# Altium project LimeSDR-X3_1v0.PrjPcb (part 7 of 19)

## Sheet 15_LMS2_RF1_Misc.SchDoc: LMS2 RF1 Misc
size A3; Organization: Lime Microsystems; Address1: Surrey Tech Centre; Address2: Guildford GU2 7YG; Address3: Surrey; Address4: United Kingdom; Revision: v1.0; SheetNumber: 15; SheetTotal: 31
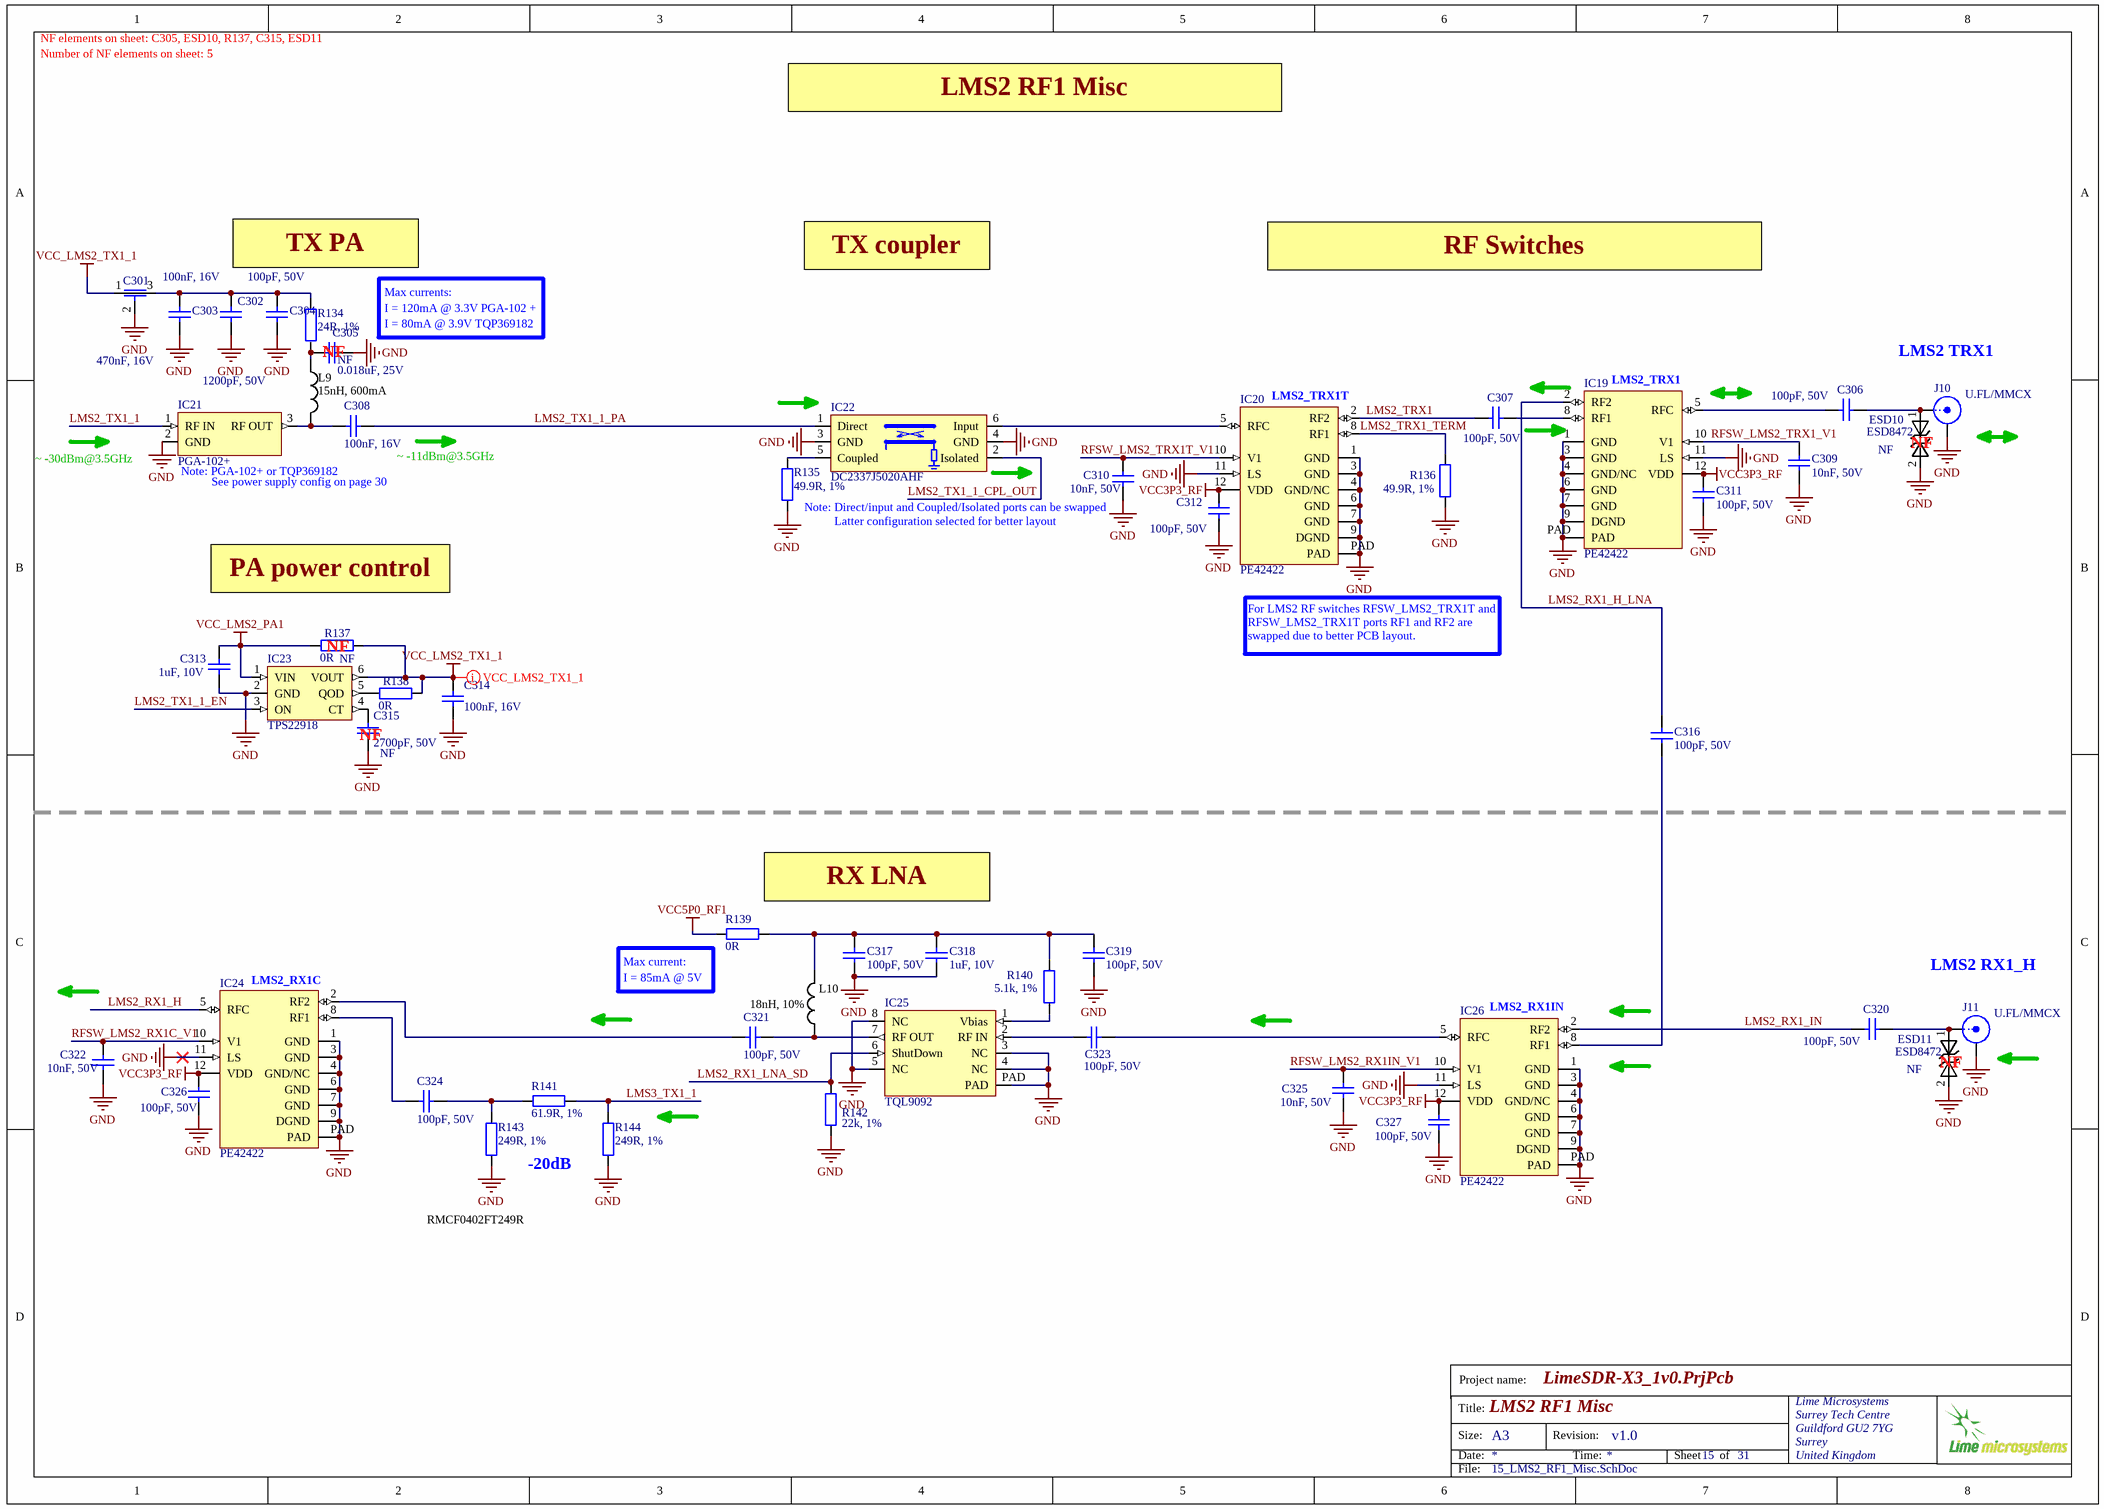
[diagram p14: 15_LMS2_RF1_Misc.SchDoc]

### Parts
C301  470nF, 16V  [CAP0805_FEEDTHROUGH]
C302  1200pF, 50V  [CAP0402]
C303  100nF, 16V  [CAP0402]
C304  100pF, 50V  [CAP0402]
C305  0.018uF, 25V  Assembly Info: NF  [CAP0402]
C306  100pF, 50V  [CAP0402]
C307  100pF, 50V  [CAP0402]
C308  100nF, 16V  [CAP0402]
C309  10nF, 50V  [CAP0402]
C310  10nF, 50V  [CAP0402]
C311  100pF, 50V  [CAP0402]
C312  100pF, 50V  [CAP0402]
C313  1uF, 10V  [CAP0402]
C314  100nF, 16V  [CAP0402]
C315  2700pF, 50V  Assembly Info: NF  [CAP0402]
C316  100pF, 50V  [CAP0402]
C317  100pF, 50V  [CAP0402]
C318  1uF, 10V  [CAP0402]
C319  100pF, 50V  [CAP0402]
C320  100pF, 50V  [CAP0402]
C321  100pF, 50V  [CAP0402]
C322  10nF, 50V  [CAP0402]
C323  100pF, 50V  [CAP0402]
C324  100pF, 50V  [CAP0402]
C325  10nF, 50V  [CAP0402]
C326  100pF, 50V  [CAP0402]
C327  100pF, 50V  [CAP0402]
ESD10  ESD8472  Assembly Info: NF  [ESD8472_X3DFN2]
ESD11  ESD8472  Assembly Info: NF  [ESD8472_X3DFN2]
IC19  PE42422  [PE42422_QFN12]
IC20  PE42422  [PE42422_QFN12]
IC21  PGA-102+  [PGA-102+_SOT89]
IC22  DC2337J5020AHF  [DC2337J5020AHF_ANAREN_COUPLER_0805]
IC23  TPS22918  [SOT23-6]
IC24  PE42422  [PE42422_QFN12]
IC25  TQL9092  [TQL9092]
IC26  PE42422  [PE42422_QFN12]
J10  U.FL/MMCX  [MMCX_UFL_conn_m]
J11  U.FL/MMCX  [MMCX_UFL_conn_m]
L9  15nH, 600mA  [RES0805]
L10  18nH, 10%  [RES0603]
R134  24R, 1%  [RES0402]
R135  49.9R, 1%  [RES0402]
R136  49.9R, 1%  [RES0402]
R137  0R  Assembly Info: NF  [RES0402]
R138  0R  [RES0402]
R139  0R  [RES0402]
R140  5.1k, 1%  [RES0603]
R141  61.9R, 1%  [RES0402]
R142  22k, 1%  [RES0402]
R143  249R, 1%  [RES0402]
R144  249R, 1%  [RES0402]

### Nets
GND: C301.2 C302.2 C303.1 C304.2 C305.2 C309.2 C310.2 C311.1 C312.1 C313.1 C314.1 C315.2 C317.2 C318.1 C319.2 C322.2 C325.2 C326.1 C327.1 ESD10.2 ESD11.2 IC19.1(GND) IC19.3(GND) IC19.4(GND/NC) IC19.6(GND) IC19.7(GND) IC19.9(DGND) IC19.11(LS) IC19.PAD IC20.1(GND) IC20.3(GND) IC20.4(GND/NC) IC20.6(GND) IC20.7(GND) IC20.9(DGND) IC20.11(LS) IC20.PAD IC21.2(GND) IC22.3(GND) IC22.4(GND) IC23.2(GND) IC24.1(GND) IC24.3(GND) IC24.4(GND/NC) IC24.6(GND) IC24.7(GND) IC24.9(DGND) IC24.11(LS) IC24.PAD IC25.3(NC) IC25.4(NC) IC25.5(NC) IC25.8(NC) IC25.PAD IC26.1(GND) IC26.3(GND) IC26.4(GND/NC) IC26.6(GND) IC26.7(GND) IC26.9(DGND) IC26.11(LS) IC26.PAD J10.2(Y) J11.2(Y) R135.2 R136.2 R142.1 R143.1 R144.1
VCC3P3_RF: C311.2 C312.2 C326.2 C327.2 IC19.12(VDD) IC20.12(VDD) IC24.12(VDD) IC26.12(VDD)
VCC5P0_RF1: R139.1
VCC_LMS2_PA1: C313.2 IC23.1(VIN) R137.2
VCC_LMS2_TX1_1: C301.1 C314.2 IC23.6(VOUT) R137.1 R138.1
LMS2_RX1_H: IC24.5(RFC)
LMS2_RX1_H_LNA: C316.2 IC19.2(RF2)
LMS2_RX1_IN: C320.1 IC26.2(RF2)
LMS2_RX1_LNA_SD: IC25.6(ShutDown) R142.2
LMS2_TRX1: C307.1 IC20.2(RF2)
LMS2_TRX1_TERM: IC20.8(RF1) R136.1
LMS2_TX1_1: IC21.1(RF_IN)
LMS2_TX1_1_CPL_OUT: IC22.2(Isolated)
LMS2_TX1_1_EN: IC23.3(ON)
LMS2_TX1_1_PA: C308.1 IC22.1(Direct)
LMS3_TX1_1: R141.2 R144.2
RFSW_LMS2_RX1C_V1: C322.1 IC24.10(V1)
RFSW_LMS2_RX1IN_V1: C325.1 IC26.10(V1)
RFSW_LMS2_TRX1_V1: C309.1 IC19.10(V1)
RFSW_LMS2_TRX1T_V1: C310.1 IC20.10(V1)
NetC301_3: C301.3 C302.1 C303.2 C304.1 R134.1
NetC305_1: C305.1 L9.1 R134.2
NetC306_1: C306.1 IC19.5(RFC)
NetC306_2: C306.2 ESD10.1 J10.1(X)
NetC307_2: C307.2 IC19.8(RF1)
NetC308_2: C308.2 IC21.3(RF_OUT) L9.2
NetC315_1: C315.1 IC23.4(CT)
NetC316_1: C316.1 IC26.8(RF1)
NetC317_1: C317.1 C318.2 C319.1 L10.1 R139.2 R140.2
NetC320_2: C320.2 ESD11.1 J11.1(X)
NetC321_1: C321.1 IC24.2(RF2)
NetC321_2: C321.2 IC25.7(RF_OUT) L10.2
NetC323_1: C323.1 IC25.2(RF_IN)
NetC323_2: C323.2 IC26.5(RFC)
NetC324_1: C324.1 R141.1 R143.2
NetC324_2: C324.2 IC24.8(RF1)
NetIC20_5: IC20.5(RFC) IC22.6(Input)
NetIC22_5: IC22.5(Coupled) R135.1
NetIC23_5: IC23.5(QOD) R138.2
NetIC25_1: IC25.1(Vbias) R140.1

### Layout directives
net class VCC_LMS2_TX1_1: VCC_LMS2_TX1_1

### Notes on the sheet
- NF elements on sheet: C305, ESD10, R137, C315, ESD11
- Number of NF elements on sheet: 5
- LMS2 RF1 Misc
- TX PA
- I = 120mA @ 3.3V PGA-102 +
- Max currents:
- TX coupler
- RF Switches
- (near C301) Ch1
- NF
- I = 80mA @ 3.9V TQP369182
- (near IC19) LMS2_TRX1
- LMS2 TRX1
- (near IC20) LMS2_TRX1T
- (near ESD10) NF
- (near IC21) ~ -30dBm@3.5GHz
- (near IC21) Note: PGA-102+ or TQP369182
- See power supply config on page 30
- (near C308) ~ -11dBm@3.5GHz
- Note: Direct/input and Coupled/Isolated ports can be swapped
- PA power control
- (near C310) Latter configuration selected for better layout
- (near R137) NF
- (near IC20) For LMS2 RF switches RFSW_LMS2_TRX1T and RFSW_LMS2_TRX1T ports RF1 and RF2 are swapped due to better PCB layout.
- (near C315) NF
- RX LNA
- (near IC24) LMS2_RX1C
- I = 85mA @ 5V
- (near R139) Max current:
- LMS2 RX1_H
- (near IC26) LMS2_RX1IN
- (near ESD11) NF
- -20dB
- RMCF0402FT249R
- Project name:
- Title:
- Size:
- Date:
- A3
- Revision:
- Time:
- Sheet
- of
- File:

### Library data of the parts
C301 = Cap_feed_through: as C271 on sheet 14_LMS1_RF_PA; Value: 470nF, 16V; Supplier 1: Digi-Key; Supplier Part Number 1: 490-2537-1-ND; Stock 1: 220606; Pricing 1: 1=0,25000, 10=0,22900, 25=0,21840, 50=0,21160, 100=0,20450, 250=0,19392, 500=0,16218, 1000=0,12586 (USD); Mount: Surface Mount,PCB; Case/Package: 0805; Weight: 0.000194oz; Case Code (Metric): 2012; Case Code (Imperial): 0805; Min Operating Temperature: -55°C; Max Operating Temperature: 125°C; Package Quantity: 1; Capacitance: 470nF; Packaging: Tape and Reel; Max Voltage Rating (DC): 16V; Current Rating: 2A; Voltage Rating: 16V; Voltage Rating (DC): 16V; Voltage: 16V; Current: 2A; Termination: Flat; Length: 2mm; Height: 0.85mm; Width: 1.25mm; Depth: 1.25mm; Radiation Hardening: No; REACH SVHC: No SVHC; Lead Free: Lead Free; RoHS: Yes
C302 = Cap_0402: Manufacturer: Kemet; Manufacturer Part Number 1: C0402C122J5GACTU; Part Description: 1200pF ±5% 50V Ceramic Capacitor C0G, NP0 0402 (1005 Metric); Temperature Coefficient: C0G, NP0; Tolerance: ±5%; Value: 1200pF, 50V; Supplier 1: Digi-Key; Supplier Part Number 1: 399-7334-1-ND; Thickness (Max): 0.022" (0.55mm); Capacitance: 1200pF; Lead Spacing: -; Mounting Type: Surface Mount, MLCC; Package / Case: 0402 (1005 Metric); Category: Capacitors; Size / Dimension: 0.039" L x 0.020" W (1.00mm x 0.50mm); Voltage - Rated: 50V; Lead Style: -; Ratings: -; Features: -; Packaging: Cut Tape (CT); RoHS: RoHS Compliant; Operating Temperature: -55°C ~ 125°C; Applications: General Purpose; Height - Seated (Max): -
C303 C308 C314 = Cap_0402: as C262 on sheet 14_LMS1_RF_PA; Value: 100nF, 16V; Supplier 1: Mouser; Supplier Part Number 1: 81-GRM155R71C104KA88; Case Code - in: 0402; RoHS: RoHS Compliant; Operating Temperature Range: - 55 C to + 125 C; Series: GRM; Termination Style: SMD/SMT; Package / Case: 0402 (1005 metric); Voltage Rating DC: 16 V; Maximum Operating Temperature: + 125 C; Case Code - mm: 1005; Minimum Operating Temperature: - 55 C; Product Category: Low & Medium Capacitance SMD Ceramic Chip Capacitors; Packaging: Reel; Product: General Type MLCCs; Category: Multilayer Ceramic Capacitors MLCC - SMD/SMT; Brand: Murata Electronics; Case Width: 0.5 mm; RoHS - Mouser: Y; Standard Pack Qty: 10000; Minimum Order Quantity: 1; Reeling: True
C304 C306 C307 C311 C312 C316 C317 C319-C321 C323 C324 C326 C327 = Cap_0402: as C264 on sheet 14_LMS1_RF_PA; Value: 100pF, 50V; Capacitance: 100pF; Thickness (Max): 0.022" (0.55mm); Size / Dimension: 0.039" L x 0.020" W (1.00mm x 0.50mm); RoHS: RoHS Compliant; Ratings: -; Package / Case: 0402 (1005 Metric); Mounting Type: Surface Mount, MLCC; Height - Seated (Max): -; Features: -; Lead Spacing: -; Voltage - Rated: 50V; Operating Temperature: -55°C ~ 125°C; Packaging: Cut Tape (CT); Applications: General Purpose; Lead Style: -; Supplier 1: Digi-Key; Category: Capacitors; Supplier Part Number 1: 311-1024-1-ND
C305 = Cap_0402: Part Description: 0.018µF ±10% 25V Ceramic Capacitor X7R 0402 (1005 Metric); Manufacturer: Yageo; Manufacturer Part Number 1: CC0402KRX7R8BB183; Capacitance: 18nF; Tolerance: 10%; Dielectric: X7R; Value: 0.018uF, 25V; ComponentLink1URL: http://www.murata.com/~/media/webrenewal/support/library/catalog/products/capacitor/mlcc/c02e.ashx?la=en-us; ComponentLink1Description: http://www.murata.com/~/media/webrenewal/support/library/catalog/products/capacitor/mlcc/c02e.ashx?la=en-us; Supplier 1: Digi-Key; Supplier Part Number 1: 311-3345-1-ND; Stock 1: 39602; Pricing 1: 1=0,10000, 10=0,05000, 100=0,02210, 500=0,01580, 1000=0,01242, 2500=0,01129, 5000=0,01038 (USD); RoHS: Yes; Mount: Surface Mount; Case/Package: 0402; Min Operating Temperature: -55°C; Max Operating Temperature: 125°C; Packaging: Tape and Reel; Voltage Rating: 25V; Voltage Rating (DC): 25V; Length: 0.039inch; Width: 0.02inch; Thickness: 0.022inch; Lead Free: Lead Free; Halogen Free: Halogen Free; ComponentLink2URL: http://www.yageo.com/documents/recent/UPY-GPHC_X7R_6.3V-to-50V_18.pdf?src-supplier=Digi-Key; ComponentLink2Description: http://www.yageo.com/documents/recent/UPY-GPHC_X7R_6.3V-to-50V_18.pdf?src-supplier=Digi-Key; ComponentLink3URL: http://www.yageo.com/documents/recent/UPY-GPHC_X7R_6.3V-to-50V_16.pdf?src-supplier=Digi-Key; ComponentLink3Description: http://www.yageo.com/documents/recent/UPY-GPHC_X7R_6.3V-to-50V_16.pdf?src-supplier=Digi-Key
C309 C310 C322 C325 = Cap_0402: as C259 on sheet 14_LMS1_RF_PA; Value: 10nF, 50V; Supplier 1: Digi-Key; Supplier Part Number 1: 490-4516-2-ND; RoHS: RoHS Compliant; Category: Capacitors; Stock 1: 10970000; Pricing 1: 10000=0.00185, 20000=0.00176, 30000=0.00167 (USD); Packaging: Tape & Reel (TR); Part Status: Active; Voltage - Rated: 50V; Operating Temperature: -55°C ~ 125°C; Features: -; Ratings: -; Applications: General Purpose; Mounting Type: Surface Mount, MLCC; Package / Case: 0402 (1005 Metric); Size / Dimension: 0.039" L x 0.020" W (1.00mm x 0.50mm); Height - Seated (Max): -; Thickness (Max): 0.022" (0.55mm); Lead Spacing: -; Lead Style: -; ComponentLink1URL: http://www.murata.com/~/media/webrenewal/support/library/catalog/products/capacitor/mlcc/c02e.ashx?la=en-us; ComponentLink1Description: http://www.murata.com/~/media/webrenewal/support/library/catalog/products/capacitor/mlcc/c02e.ashx?la=en-us
C313 C318 = Cap_0402: as C261 on sheet 14_LMS1_RF_PA; Value: 1uF, 10V; Supplier 1: Digi-Key; Supplier Part Number 1: 445-9066-1-ND; MSL: -; RoHS: YES
C315 = Cap_0402: as C265 on sheet 14_LMS1_RF_PA; Value: 2700pF, 50V; Size / Dimension: 0.039" L x 0.020" W (1.00mm x 0.50mm); Supplier 1: Digi-Key; Height - Seated (Max): -; Package / Case: 0402 (1005 Metric); Supplier Part Number 1: 490-6361-1-ND; Part Status: Active; RoHS: RoHS Compliant; Operating Temperature: -55°C ~ 125°C; Category: Capacitors; Ratings: -; Features: -; Packaging: Cut Tape (CT); Mounting Type: Surface Mount, MLCC; Voltage - Rated: 50V; Lead Spacing: -; Thickness (Max): 0.022" (0.55mm); Applications: General Purpose
ESD10 ESD11 = ESD8472: as ESD8 on sheet 14_LMS1_RF_PA; Supplier 1: Digi-Key; RoHS: RoHS Compliant; Category: Circuit Protection; Stock 1: 2295; Pricing 1: 1=0.39, 10=0.315, 100=0.2142, 500=0.16068, 1000=0.12051 (USD); Packaging: Cut Tape (CT); Part Status: Active; Type: Zener; Power - Peak Pulse: -; Applications: Automotive, RF Antenna; Operating Temperature: -55°C ~ 150°C (TJ); Mounting Type: Surface Mount; Package / Case: 2-XFDFN; Supplier Device Package: 2-X3DFN (0.62x0.32); ComponentLink1URL: http://www.onsemi.com/pub/Collateral/ESD8472-D.PDF; ComponentLink1Description: http://www.onsemi.com/pub/Collateral/ESD8472-D.PDF; Supplier Part Number 1: ESD8472MUT5GOSCT-ND
IC19 IC20 IC24 IC26 = PE42422: Manufacturer: Peregrine Semiconductor; Manufacturer Part Number 1: PE42422MLAA-Z; Part Description: IC RF SWITCH SPDT 50 OHM 12QFN; Frequency - Lower: 100MHz; Isolation @ Frequency: 17dB @ 6GHz (typ); Insertion Loss @ Frequency: 0.9dB @ 6GHz; IIP3: 70dBm (typ); Topology: Reflective; Circuit: SPDT; Impedance: 50 Ohm; Voltage - Supply: 2.3 V ~ 5.5 V; RF Type: General Purpose; Supplier 1: Digi-Key; RoHS: RoHS Compliant; Category: RF/IF and RFID; Stock 1: 21993; Pricing 1: 1=1.32, 101=0.92 (USD); Packaging: Cut Tape (CT); Part Status: Active; P1dB: -; Features: -; Operating Temperature: -40°C ~ 85°C; Package / Case: 12-UFQFN Exposed Pad; Supplier Device Package: 12-QFN (2x2); ComponentLink1URL: http://www.psemi.com/pdf/datasheets/pe42422ds.pdf; ComponentLink1Description: http://www.psemi.com/pdf/datasheets/pe42422ds.pdf; Supplier Part Number 1: 1046-1062-1-ND
IC21 = PGA-102+_PA: Part Description: RF Amplifier DC-6GHz NF 3.9dB Gain 21.3dB 50 Ohm; Manufacturer: Qorvo; Manufacturer Part Number 1: TQP369182; Supplier Part Number 1: 772-TQP369182; Supplier 1: Mouser
IC22 = DC2337J5020AHF_coupler: Part Description: RF Directional Coupler General Purpose 2.3GHz ~ 3.7GHz 21.3dB 2W 0805 (2012 Metric); Manufacturer: Anaren; Supplier Part Number 1: 1173-1090-2-ND; Manufacturer Part Number 1: DC2337J5020AHF; Supplier 1: Digi-Key
IC23 = TPS22918: as IC13 on sheet 14_LMS1_RF_PA; Supplier 1: Digi-Key; RoHS: RoHS Compliant; Category: Integrated Circuits (ICs); Stock 1: 16592; Pricing 1: 1=0.63, 10=0.551, 100=0.4222 (USD); Packaging: Digi-Reel®; Part Status: Active; Features: Load Discharge, Slew Rate Controlled; Fault Protection: -; Operating Temperature: -40°C ~ 105°C (TA); Package / Case: SOT-23-6; Supplier Device Package: SOT-23-6; ComponentLink1URL: http://www.ti.com/lit/ds/symlink/tps22918.pdf; ComponentLink1Description: http://www.ti.com/lit/ds/symlink/tps22918.pdf; Supplier Part Number 1: 296-44073-6-ND
IC25 = TQL9092: Part Description: RF Amplifier .6-4.2GHz NF .6dB Flat Gain 2dB; Manufacturer: Qorvo; Manufacturer Part Number 1: TQL9092; Supplier 1: Mouser; Supplier Part Number 1: 772-TQL9092
J10 J11 = RF_IF_connector: as J8 on sheet 14_LMS1_RF_PA; Fastening Type: SNAP-ON; Housing Color: Black; Packaging: Tape and Reel; RoHS: Yes; Supplier 1: Digi-Key; Supplier Part Number 1: ARF1725CT-ND; Body Plating: Gold; Case/Package: 908; ComponentLink1Description: https://datasheet.ciiva.com/5177/c908-22101t-37976-5177328.pdf?src-supplier=Mouser; ComponentLink1URL: https://datasheet.ciiva.com/5177/c908-22101t-37976-5177328.pdf?src-supplier=Mouser; ComponentLink2Description: https://datasheet.ciiva.com/643/c908-22101t-643558.pdf?src-supplier=Digi-Key; ComponentLink2URL: https://datasheet.ciiva.com/643/c908-22101t-643558.pdf?src-supplier=Digi-Key; ComponentLink3Description: https://datasheet.ciiva.com/7662/1636995-7662651.pdf?src-supplier=Element14; ComponentLink3URL: https://datasheet.ciiva.com/7662/1636995-7662651.pdf?src-supplier=Element14; ComponentLink4Description: https://datasheet.ciiva.com/5689/c908-22101t-5689787.pdf?src-supplier=Farnell; ComponentLink4URL: https://datasheet.ciiva.com/5689/c908-22101t-5689787.pdf?src-supplier=Farnell; ComponentLink5Description: https://datasheet.ciiva.com/7996/691284-7996807.pdf?src-supplier=Element14; ComponentLink5URL: https://datasheet.ciiva.com/7996/691284-7996807.pdf?src-supplier=Element14; ComponentLink6Description: https://datasheet.ciiva.com/643/c908-22101t-643559.pdf?src-supplier=Digi-Key; ComponentLink6URL: https://datasheet.ciiva.com/643/c908-22101t-643559.pdf?src-supplier=Digi-Key; ComponentLink7Description: https://datasheet.ciiva.com/643/c908-22101t-643560.pdf?src-supplier=Digi-Key; ComponentLink7URL: https://datasheet.ciiva.com/643/c908-22101t-643560.pdf?src-supplier=Digi-Key; Contact Material: Copper; Contact Plating: Gold; Depth: 4.32mm; Insulation Material: Polymer; Length: 4.32mm; Max Frequency: 6GHz; Max Operating Temperature: 155°C; Min Operating Temperature: -40°C; Mount: Surface Mount,PCB; Orientation: Straight; Package Quantity: 1; Plating: Gold; Pricing 1: 1=6,18000, 10=5,60700, 25=5,31040, 50=5,18700, 100=4,94000, 250=4,32248, 500=4,19900 (USD); Radiation Hardening: No; REACH SVHC: Unknown; Series: MicroMate™; Stock 1: 6928; Termination: Solder
L9 = Inductor_0603: Manufacturer: Bourns; Manufacturer Part Number 1: CW201212-15NJ; Part Description: 15nH Unshielded Wirewound Inductor 600mA 80mOhm 0805 (2012 Metric); Core Material: Ceramic; Tolerance: 5%; Self Resonant Frequency: 3.6GHz; Shielding: Unshielded; Q Factor: 60; DC Resistance (DCR): 80mR; Test Frequency: 250MHz; Value: 15nH, 600mA; Supplier 1: Digi-Key; Supplier Part Number 1: CW201212-15NJDKR-ND; Stock 1: 2733; Pricing 1: 1=0.37, 10=0.327, 100=0.2245, 500=0.19188, 1000=0.14697 (USD); Mount: Surface Mount; Case/Package: 0805; Weight: 0.000194oz; Case Code (Metric): 2012; Case Code (Imperial): 0805; Min Operating Temperature: -40°C; Max Operating Temperature: 125°C; Package Quantity: 2000; Packaging: Tape and Reel; Current Rating: 600mA; Inductance: 15nH; Max DC Current: 600mA; Termination: SMD/SMT; Composition: Wirewound,Ceramic; DC Current: 600mA; Military Standard: Not; Length: 0.083inch; Height: 0.051inch; Width: 1.5mm; Height - Seated (Max): 0.059inch; Depth: 1.7mm; Radiation Hardening: No; ComponentLink1URL: http://www.bourns.com/data/global/PDFs/CW201212.pdf?src-supplier=Avnet+Europe; ComponentLink1Description: http://www.bourns.com/data/global/PDFs/CW201212.pdf?src-supplier=Avnet+Europe; ComponentLink2URL: http://www.bourns.com/data/global/pdfs/CW201212.pdf?src-supplier=Digi-Key; ComponentLink2Description: http://www.bourns.com/data/global/pdfs/CW201212.pdf?src-supplier=Digi-Key; ComponentLink3URL: http://www.bourns.com/data/global/PDFs/CW201212.pdf?src-supplier=Avnet; ComponentLink3Description: http://www.bourns.com/data/global/PDFs/CW201212.pdf?src-supplier=Avnet; ComponentLink4URL: http://www.onlinecomponents.com/productFiles/mf-BO/cw201212.pdf?src-supplier=Onlinecomponents.com; ComponentLink4Description: http://www.onlinecomponents.com/productFiles/mf-BO/cw201212.pdf?src-supplier=Onlinecomponents.com
L10 = Inductor: as L1 on sheet 14_LMS1_RF_PA; Value: 18nH, 10%; Supplier 1: Digi-Key; Supplier Part Number 1: 1840-1105-1-ND; RoHS: RoHS Compliant; Category: Inductors, Coils, Chokes; Stock 1: 14000; Pricing 1: 1=0.41, 10=0.368, 100=0.253, 500=0.2162, 1000=0.1656 (USD); Packaging: Cut Tape (CT); Part Status: Active; Tolerance: ±10%; Ratings: -; Operating Temperature: -40°C ~ 125°C; Mounting Type: Surface Mount; Package / Case: 0603 (1608 Metric); Supplier Device Package: 0603 (1608 Metric); Size / Dimension: 0.071" L x 0.049" W (1.80mm x 1.24mm); Height - Seated (Max): 0.040" (1.02mm); ComponentLink1URL: http://productfinder.pulseeng.com/products/datasheets/WC701.pdf; ComponentLink1Description: http://productfinder.pulseeng.com/products/datasheets/WC701.pdf
R134 = Res_0402: as R111 on sheet 14_LMS1_RF_PA; Value: 24R, 1%; Supplier 1: Digi-Key; Supplier Part Number 1: 13-AC0402FR-0724RLCT-ND; Stock 1: 14420; Pricing 1: 1=0.1, 10=0.022, 100=0.009, 1000=0.00402, 2500=0.00349, 5000=0.00288 (USD); Case/Package: 0402; Min Operating Temperature: -55°C; Max Operating Temperature: 155°C; Packaging: Tape and Reel; Resistance: 24R; Resistor Type: Thick Film; Number of Terminations: 2; Tolerance: 1%; Features: Moisture Resistant,Automotive AEC-Q200; Length: 0.039inch; Width: 0.02inch; Height: 0.015inch; RoHS Compliant: Yes; ComponentLink1URL: http://www.yageo.com/NewPortal/yageodocoutput?fileName=/pdf/R-Chip/PYu-AC_51_RoHS_L_6.pdf&src-supplier=Digi-Key; ComponentLink1Description: http://www.yageo.com/NewPortal/yageodocoutput?fileName=/pdf/R-Chip/PYu-AC_51_RoHS_L_6.pdf&src-supplier=Digi-Key
R135 R136 = Res_0402: Manufacturer: Samsung Electro-Mechanics America, Inc.; Manufacturer Part Number: RC1005F49R9CS; Part Description: RES SMD 49.9 OHM 1% 1/16W 0402; Temperature Coefficient: ±100ppm/°C; Resistance (Ohms): 49.9; Power (Watts): 0.063W, 1/16W; Number of Terminations: 2; Size / Dimension: 0.039" L x 0.020" W (1.00mm x 0.50mm); Supplier Device Package: 0402 (1005 Metric); RoHS: RoHS Compliant; Supplier Part Number 1: 1276-3469-6-ND; Features: -; Packaging: Digi-Reel®; Tolerance: ±1%; Height: 0.016" (0.40mm); Category: Resistors; Composition: Thick Film; Package / Case: 0402 (1005 Metric); Supplier 1: Digi-Key; Operating Temperature: -55°C ~ 155°C; Value: 49.9R, 1%; Manufacturer Part Number 1: RC1005F49R9CS
R137-R139 = Res_0402: as R110 on sheet 14_LMS1_RF_PA; Value: 0R; Supplier 1: Digi-Key; Supplier Part Number 1: 311-0.0JRTR-ND; Category: Resistors; Temperature Coefficient: -; Features: Moisture Resistant; Supplier Device Package: 0402; Height: 0.016" (0.40mm); Package / Case: 0402 (1005 Metric); Operating Temperature: -55°C ~ 155°C; Size / Dimension: 0.039" L x 0.020" W (1.00mm x 0.50mm); Composition: Thick Film; Packaging: Tape & Reel (TR); Number of Terminations: 2; RoHS: RoHS Compliant
R140 = Res_0603: Part Description: 5.1 kOhms ±1% 0.1W, 1/10W Chip Resistor 0603 (1608 Metric) Automotive AEC-Q200 Thick Film; Manufacturer: Stackpole Electronics; Manufacturer Part Number 1: RMCF0603FT5K10; Resistance: 5.1kR; Max Power Dissipation: 100mW; Temperature Coefficient: 100ppm/°C; Value: 5.1k, 1%; ComponentLink1URL: https://industrial.panasonic.com/cdbs/www-data/pdf/RDA0000/AOA0000C304.pdf; ComponentLink1Description: https://industrial.panasonic.com/cdbs/www-data/pdf/RDA0000/AOA0000C304.pdf; Supplier 1: Digi-Key; Supplier Part Number 1: RMCF0603FT5K10CT-ND; Stock 1: 1507174; Pricing 1: 1=0,10000, 10=0,01500, 100=0,00610, 1000=0,00273, 2500=0,00237 (USD); RoHS: Yes; Mount: Surface Mount; Case/Package: 0603; Case Code (Metric): 1608; Case Code (Imperial): 0603; Contact Plating: Tin,Matte; Min Operating Temperature: -55°C; Max Operating Temperature: 155°C; Tolerance: 1%; Packaging: Tape and Reel; Resistor Type: Thick Film; Number of Terminations: 2; Features: Automotive AEC-Q200; Series: RMCF; Length: 0.061inch; Width: 0.031inch; Height: 0.022inch; Radiation Hardening: No; RoHS Compliant: Yes; ComponentLink2URL: http://components.arrow.com/part/dataview/50863347S9465827N1174?src-supplier=Arrow+Electronics; ComponentLink2Description: http://components.arrow.com/part/dataview/50863347S9465827N1174?src-supplier=Arrow+Electronics; ComponentLink3URL: https://www.seielect.com/catalog/SEI-RMCF_RMCP.pdf?src-supplier=Avnet; ComponentLink3Description: https://www.seielect.com/catalog/SEI-RMCF_RMCP.pdf?src-supplier=Avnet; ComponentLink4URL: https://www.seielect.com/catalog/SEI-Packaging.pdf?src-supplier=Digi-Key; ComponentLink4Description: https://www.seielect.com/catalog/SEI-Packaging.pdf?src-supplier=Digi-Key
R141 = Res_0402: Part Description: 61.9 Ohms ±1% 0.063W, 1/16W Chip Resistor 0402 (1005 Metric) Moisture Resistant Thick Film; Manufacturer: Yageo; Manufacturer Part Number 1: RC0402FR-0761R9L; Voltage Rating: 50V; Power Rating: 62.5mW; Temperature Coefficient: 100ppm/°C; Max Power Dissipation: 63mW; Value: 61.9R, 1%; Supplier 1: Digi-Key; Supplier Part Number 1: 311-61.9LRCT-ND; Stock 1: 93771; Pricing 1: 1=0,10000, 10=0,01600, 100=0,00660, 1000=0,00299, 2500=0,00259, 5000=0,00214 (USD); RoHS: Yes; Case/Package: 0402; Case Code (Imperial): 0402; Case Code (Metric): 1005; Min Operating Temperature: -55°C; Max Operating Temperature: 155°C; Resistance: 61.9R; Tolerance: 1%; Packaging: Tape and Reel; Resistor Type: Thick Film; Number of Terminations: 2; Termination: SMD/SMT; Features: Moisture Resistant; Series: RC; Construction: Rectangular; Length: 1mm; Width: 0.5mm; Height: 0.016inch; Depth: 0.5mm; Military Standard: Not; Lead Free: Lead Free; RoHS Compliant: Yes; ComponentLink1URL: https://datasheet.ciiva.com/12577/pyu-rc0402-51-rohs-l-6-r-12577388.pdf?src-supplier=Mouser; ComponentLink1Description: https://datasheet.ciiva.com/12577/pyu-rc0402-51-rohs-l-6-r-12577388.pdf?src-supplier=Mouser; ComponentLink2URL: https://datasheet.ciiva.com/17332/pyu-rc0402-51-rohs-l-6-17332587.pdf?src-supplier=Future+Electronics; ComponentLink2Description: https://datasheet.ciiva.com/17332/pyu-rc0402-51-rohs-l-6-17332587.pdf?src-supplier=Future+Electronics; ComponentLink3Description: https://datasheet.ciiva.com/2453/pyu-r-int-thick-7-2453707.pdf?src-supplier=Digi-Key; ComponentLink3URL: https://datasheet.ciiva.com/2453/pyu-r-int-thick-7-2453707.pdf?src-supplier=Digi-Key; ComponentLink4Description: https://datasheet.ciiva.com/2453/pyu-r-int-thick-7-2453708.pdf?src-supplier=Digi-Key; ComponentLink4URL: https://datasheet.ciiva.com/2453/pyu-r-int-thick-7-2453708.pdf?src-supplier=Digi-Key; ComponentLink5Description: https://datasheet.ciiva.com/2453/pyu-r-int-thick-7-2453706.pdf?src-supplier=Digi-Key; ComponentLink5URL: https://datasheet.ciiva.com/2453/pyu-r-int-thick-7-2453706.pdf?src-supplier=Digi-Key; ComponentLink6Description: https://datasheet.ciiva.com/8888/pyu-rc0402-51-rohs-l-6-8888591.pdf?src-supplier=Avnet; ComponentLink6URL: https://datasheet.ciiva.com/8888/pyu-rc0402-51-rohs-l-6-8888591.pdf?src-supplier=Avnet; ComponentLink7Description: https://datasheet.ciiva.com/16741/pyu-rc0402-51-rohs-l-6-r-16741941.pdf?src-supplier=Future+Electronics; ComponentLink7URL: https://datasheet.ciiva.com/16741/pyu-rc0402-51-rohs-l-6-r-16741941.pdf?src-supplier=Future+Electronics; ComponentLink8Description: https://datasheet.ciiva.com/15189/getdatasheetpartid-325045-15189495.pdf?src-supplier=Verical; ComponentLink8URL: https://datasheet.ciiva.com/15189/getdatasheetpartid-325045-15189495.pdf?src-supplier=Verical; Contact Plating: Tin,Matte,Lead; Package Quantity: 1; Radiation Hardening: No; Technology: THICK FILM; Voltage Rating (DC): 50V; Working Voltage: 50V
R142 = Res_0402: Manufacturer: Yageo; Part Description: RES SMD 22K OHM 1% 1/16W 0402; Manufacturer Part Number 1: RC0402FR-0722KL; Temperature Coefficient: ±100ppm/°C; Power (Watts): 0.063W, 1/16W; Value: 22k, 1%; Number of Terminations: 2; Operating Temperature: -55°C ~ 155°C; Package / Case: 0402 (1005 Metric); Category: Resistors; Size / Dimension: 0.039" L x 0.020" W (1.00mm x 0.50mm); Height: 0.016" (0.40mm); Supplier 1: Digi-Key; Supplier Part Number 1: 311-22.0KLRCT-ND; RoHS: RoHS Compliant; Features: Moisture Resistant; Packaging: Cut Tape (CT); Composition: Thick Film; Supplier Device Package: 0402; Resistance (Ohms): 22k; Tolerance: ±1%
R143 R144 = Res_0402: Manufacturer: Stackpole Electronics Inc; Manufacturer Part Number 1: RMCF0402FT249R; Part Description: RES SMD 249 OHM 1% 1/16W 0402; Power (Watts): 0.063W, 1/16W; Resistance (Ohms): 249; Temperature Coefficient: ±100ppm/°C; Value: 249R, 1%; Category: Resistors; Composition: Thick Film; Features: -; Height: 0.016" (0.40mm); Number of Terminations: 2; Operating Temperature: -55°C ~ 155°C; Package / Case: 0402 (1005 Metric); Packaging: Cut Tape (CT); RoHS: RoHS Compliant; Size / Dimension: 0.039" L x 0.020" W (1.00mm x 0.50mm); Supplier 1: Digi-Key; Supplier Device Package: 0402; Supplier Part Number 1: RMCF0402FT249RCT-ND; Tolerance: ±1%